# EAGLE schematic ring modulator (EAGLE 9.2.2)
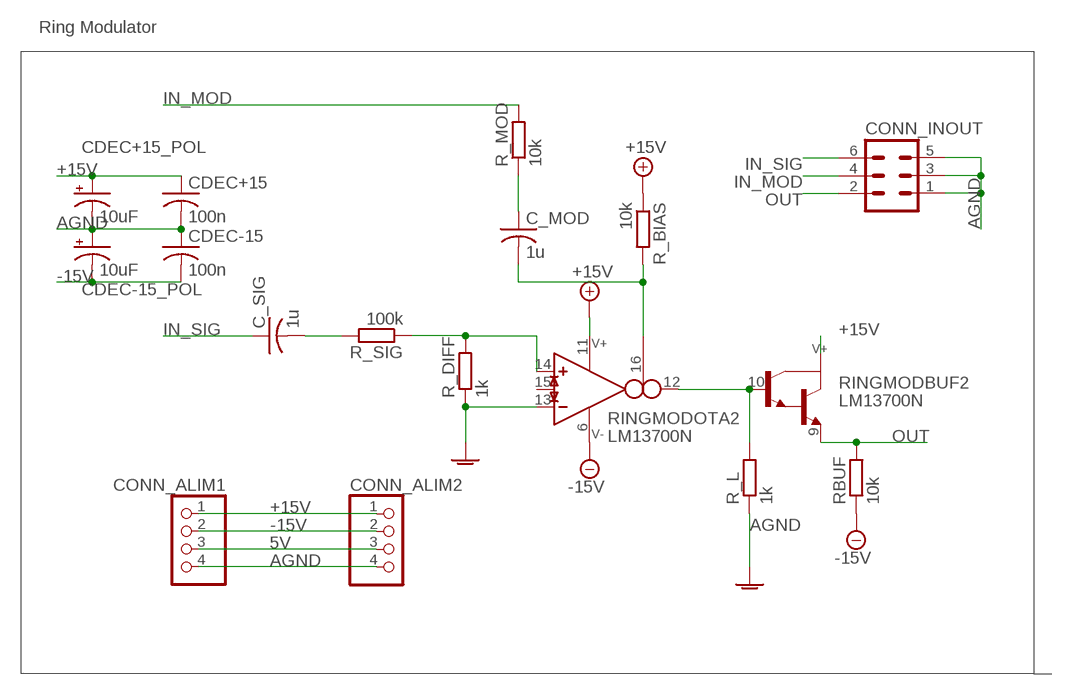
[diagram p0: schematic, sheet 1]

## Parts
C_MOD  1u  C-US050-024X044  [C050-024X044]
C_SIG  1u  C-US050-024X044  [C050-024X044]
CDEC+15  100n  C-US050-024X044  [C050-024X044]
CDEC+15_POL  10uF  10UF-POLAR-RADIAL-2.5MM-KIT-25V-20%  [CPOL-RADIAL-2.5MM-5MM-KIT]
CDEC-15  100n  C-US050-024X044  [C050-024X044]
CDEC-15_POL  10uF  10UF-POLAR-RADIAL-2.5MM-KIT-25V-20%  [CPOL-RADIAL-2.5MM-5MM-KIT]
CONN_ALIM1  PINHD-1X4  [1X04]
CONN_ALIM2  PINHD-1X4  [1X04]
CONN_INOUT  MA03-2  [MA03-2]
R_BIAS  10k  R-EU_0204/7  [0204/7]
R_DIFF  1k  R-EU_0204/7  [0204/7]
R_L  1k  R-EU_0204/7  [0204/7]
R_MOD  10k  R-EU_0204/7  [0204/7]
R_SIG  100k  R-EU_0204/7  [0204/7]
RBUF  10k  R-EU_0204/7  [0204/7]
RINGMOD  LM13700N  [DIL16]

## Nets
5V: CONN_ALIM1.3 CONN_ALIM2.3
+15V: CDEC+15.1 CDEC+15_POL.1(+) CONN_ALIM1.1 CONN_ALIM2.1 R_BIAS.1 RINGMOD.11(SUPPLY:V+)
-15V: CDEC-15.2 CDEC-15_POL.2(-) CONN_ALIM1.2 CONN_ALIM2.2 RBUF.1 RINGMOD.6(SUPPLY:V-)
AGND: CDEC+15.2 CDEC+15_POL.2(-) CDEC-15.1 CDEC-15_POL.1(+) CONN_ALIM1.4 CONN_ALIM2.4 CONN_INOUT.1 CONN_INOUT.3 CONN_INOUT.5 R_DIFF.1 R_L.1 RINGMOD.13(OTA2:IN_N)
IN_MOD: CONN_INOUT.4 R_MOD.2
IN_SIG: C_SIG.1 CONN_INOUT.6
N$27: R_DIFF.2 R_SIG.1 RINGMOD.14(OTA2:IN_P)
N$36: C_SIG.2 R_SIG.2
N$48: R_L.2 RINGMOD.10(BUF2:B) RINGMOD.12(OTA2:OUT)
N$59: C_MOD.2 R_BIAS.2 RINGMOD.16(OTA2:I_BIAS)
N$74: C_MOD.1 R_MOD.1
OUT: CONN_INOUT.2 RBUF.2 RINGMOD.9(BUF2:E)
Unconnected: RINGMOD.1(OTA1:I_BIAS) RINGMOD.2(OTA1:I_DIODE) RINGMOD.3(OTA1:IN_P) RINGMOD.4(OTA1:IN_N) RINGMOD.5(OTA1:OUT) RINGMOD.7(BUF1:B) RINGMOD.8(BUF1:E) RINGMOD.15(OTA2:I_DIODE)

## Notes on the sheet
- Ring Modulator

## Library data of the parts
C_MOD C_SIG CDEC+15 CDEC-15 = adafruit:C-US: CAPACITOR, American symbol
CDEC+15_POL CDEC-15_POL = SparkFun-Capacitors:10UF-POLAR: 10.0µF polarized capacitors A capacitor is a passive two-terminal electrical component used to store electrical energy temporarily in an electric field.; PROD_ID: CAP-08440
CONN_ALIM1 CONN_ALIM2 = pinhead:PINHD-1X4: PIN HEADER
CONN_INOUT = con-lstb:MA03-2: PIN HEADER; OC_FARNELL: unknown; OC_NEWARK: unknown
R_BIAS R_DIFF R_L R_MOD R_SIG RBUF = rcl:R-EU_: RESISTOR, European symbol; SPICEPREFIX: R
RINGMOD = ota:LM13700: Dual OTA with buffers